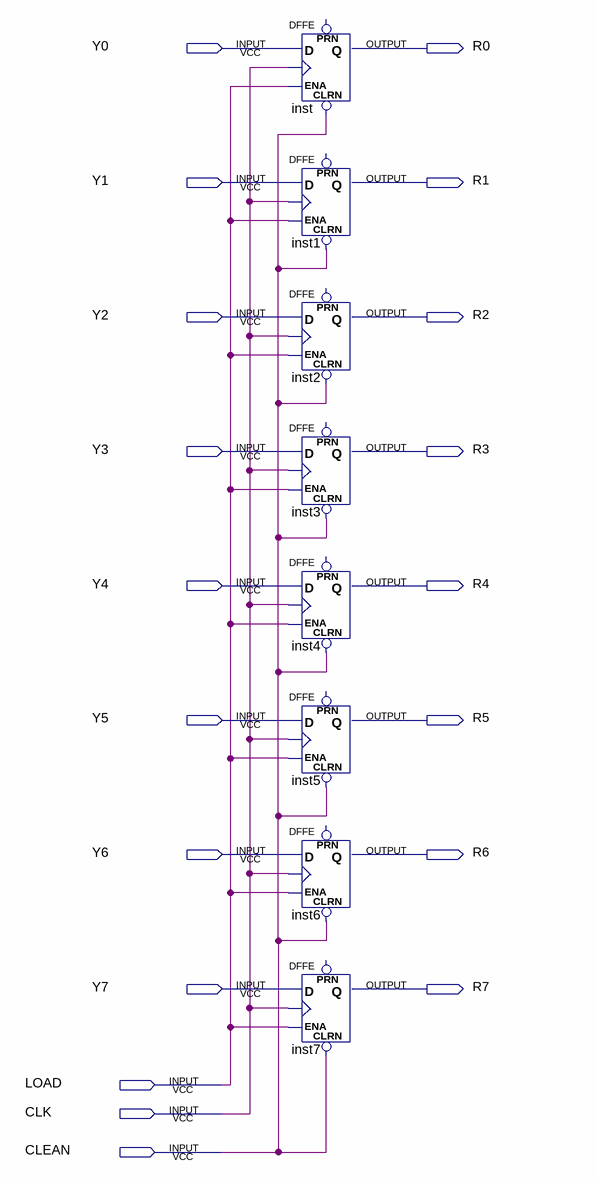
[diagram p0: schematic sheet]
// Quartus schematic 8_bit_DFF.bdf as structural Verilog: 8 symbols, 19 pins
module \8_bit_DFF  (
  input  Y0,
  input  Y1,
  input  Y2,
  input  Y3,
  input  Y4,
  input  Y5,
  input  Y6,
  input  Y7,
  input  LOAD,
  input  CLK,
  input  CLEAN,
  output R0,
  output R1,
  output R2,
  output R3,
  output R4,
  output R5,
  output R6,
  output R7
);

  DFFE inst (.CLRN(CLEAN), .D(Y0), .CLK(CLK), .ENA(LOAD), .Q(R0));  // open: PRN
  DFFE inst1 (.CLRN(CLEAN), .D(Y1), .CLK(CLK), .ENA(LOAD), .Q(R1));  // open: PRN
  DFFE inst2 (.CLRN(CLEAN), .D(Y2), .CLK(CLK), .ENA(LOAD), .Q(R2));  // open: PRN
  DFFE inst3 (.CLRN(CLEAN), .D(Y3), .CLK(CLK), .ENA(LOAD), .Q(R3));  // open: PRN
  DFFE inst4 (.CLRN(CLEAN), .D(Y4), .CLK(CLK), .ENA(LOAD), .Q(R4));  // open: PRN
  DFFE inst5 (.CLRN(CLEAN), .D(Y5), .CLK(CLK), .ENA(LOAD), .Q(R5));  // open: PRN
  DFFE inst6 (.CLRN(CLEAN), .D(Y6), .CLK(CLK), .ENA(LOAD), .Q(R6));  // open: PRN
  DFFE inst7 (.CLRN(CLEAN), .D(Y7), .CLK(CLK), .ENA(LOAD), .Q(R7));  // open: PRN
endmodule
